# EAGLE design breakout (EAGLE 6.2)
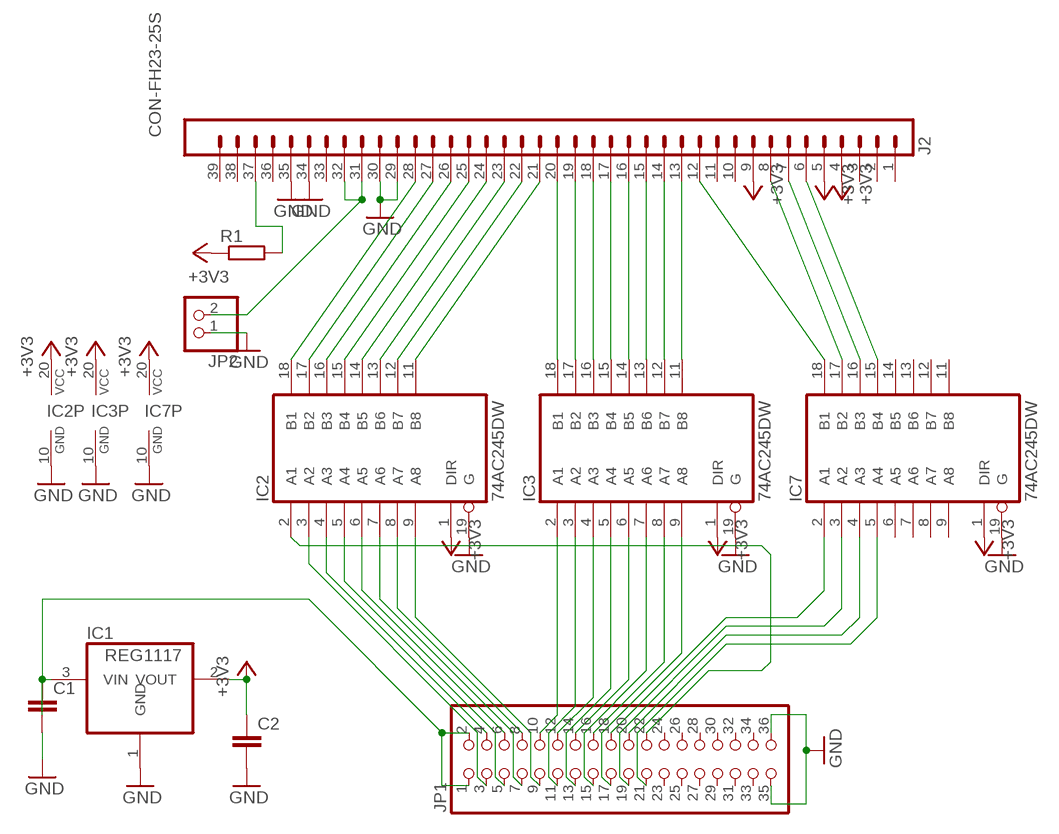
[diagram p0: schematic, sheet 1]

## Parts
C1  C-EUC0805  [C0805]
C2  C-EUC0805  [C0805]
IC1  REG1117  [SOT223]
IC2  74AC245DW  [SO20W]
IC3  74AC245DW  [SO20W]
IC7  74AC245DW  [SO20W]
J2  CON-FH23-25S  [FH23-25S]
JP1  PINHD-2X18  [2X18]
JP2  PINHD-1X2  [1X02]
R1  R-EU_R0805  [R0805]

## Nets
+3V3: C2.1 IC1.2(VOUT) IC2.1(DIR) IC2.20(VCC) IC3.1(DIR) IC3.20(VCC) IC7.1(DIR) IC7.20(VCC) J2.4 J2.5 J2.9 R1.1
GND: C1.2 C2.2 IC1.1(GND) IC2.10(GND) IC2.19(G) IC3.10(GND) IC3.19(G) IC7.10(GND) IC7.19(G) J2.29 J2.30 J2.34 J2.35 JP1.35 JP1.36 JP2.1
N$1: IC2.11(B8) J2.21
N$2: IC2.12(B7) J2.22
N$3: IC2.13(B6) J2.23
N$4: IC2.14(B5) J2.24
N$5: IC2.15(B4) J2.25
N$6: IC2.16(B3) J2.26
N$7: IC2.17(B2) J2.27
N$8: IC2.18(B1) J2.28
N$9: IC3.11(B8) J2.13
N$10: IC3.12(B7) J2.14
N$11: IC3.13(B6) J2.15
N$12: IC3.14(B5) J2.16
N$13: IC3.15(B4) J2.17
N$14: IC3.16(B3) J2.18
N$15: IC3.17(B2) J2.19
N$16: IC3.18(B1) J2.20
N$17: IC7.18(B1) J2.12
N$18: IC7.17(B2) J2.8
N$19: IC7.16(B3) J2.7
N$20: IC7.15(B4) J2.6
N$21: IC2.4(A3) JP1.4
N$22: IC2.6(A5) JP1.6
N$23: IC2.8(A7) JP1.8
N$24: IC3.2(A1) JP1.10
N$25: IC2.3(A2) JP1.3
N$26: IC2.5(A4) JP1.5
N$27: IC2.7(A6) JP1.7
N$28: IC2.9(A8) JP1.9
N$29: IC3.3(A2) JP1.11
N$30: IC3.4(A3) JP1.12
N$31: IC3.5(A4) JP1.13
N$32: IC3.6(A5) JP1.14
N$33: IC3.7(A6) JP1.15
N$34: IC3.8(A7) JP1.16
N$35: IC3.9(A8) JP1.17
N$36: IC7.2(A1) JP1.18
N$37: IC7.3(A2) JP1.19
N$38: IC7.4(A3) JP1.20
N$39: IC7.5(A4) JP1.21
N$40: IC2.2(A1) JP1.22
N$41: J2.37 R1.2
N$42: J2.31 J2.32 JP2.2
N$43: C1.1 IC1.3(VIN) JP1.1 JP1.2
Unconnected: IC7.6(A5) IC7.7(A6) IC7.8(A7) IC7.9(A8) IC7.11(B8) IC7.12(B7) IC7.13(B6) IC7.14(B5) J2.1 J2.2 J2.3 J2.10 J2.11 J2.33 J2.36 J2.38 J2.39 JP1.23 JP1.24 JP1.25 JP1.26 JP1.27 JP1.28 JP1.29 JP1.30 JP1.31 JP1.32 JP1.33 JP1.34

## Library data of the parts
C1 C2 = rcl:C-EU: CAPACITOR, European symbol
IC1 = burr-brown:REG1117: 800mA and 1A Low Dropout (LDO) Positive Regulator 1.8V, 2.5V, 2.85V, 3.3V, 5V, and Adj; MPN: REG1117; OC_FARNELL: 1097566; OC_NEWARK: 14P6981
IC2 IC3 IC7 = 74xx-eu:74*245: Octal BUS TRANSCEIVER, 3-state
J2 = dummylcd:CON-FH23-25S
JP1 = pinhead:PINHD-2X18: PIN HEADER
JP2 = pinhead:PINHD-1X2: PIN HEADER
R1 = rcl:R-EU_: RESISTOR, European symbol

## Board
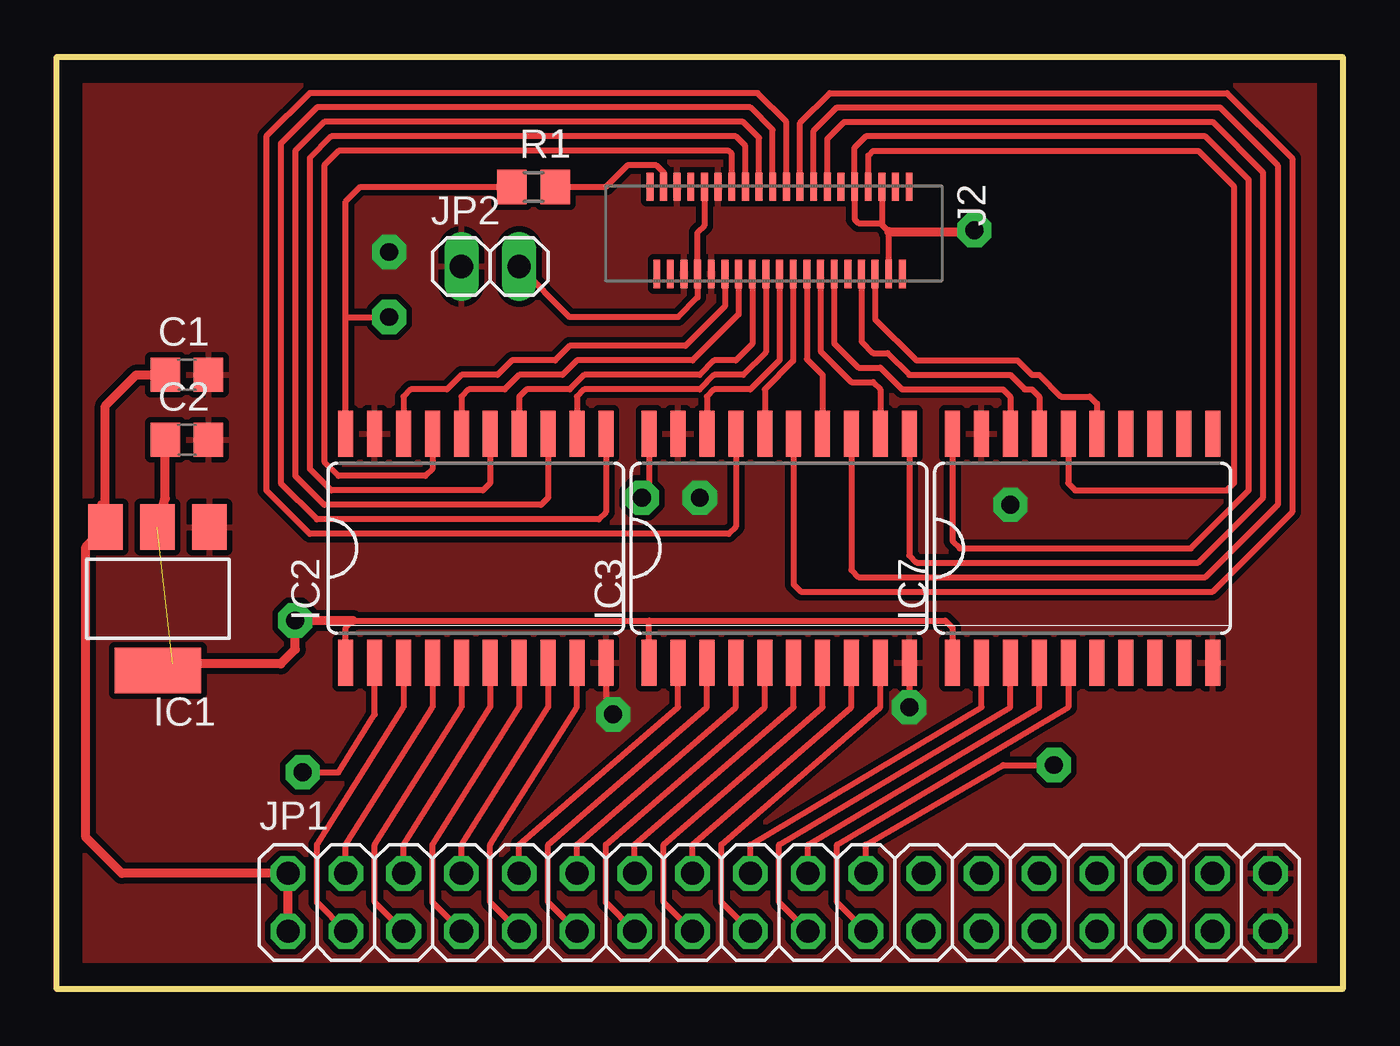
[diagram p1: board, top side]
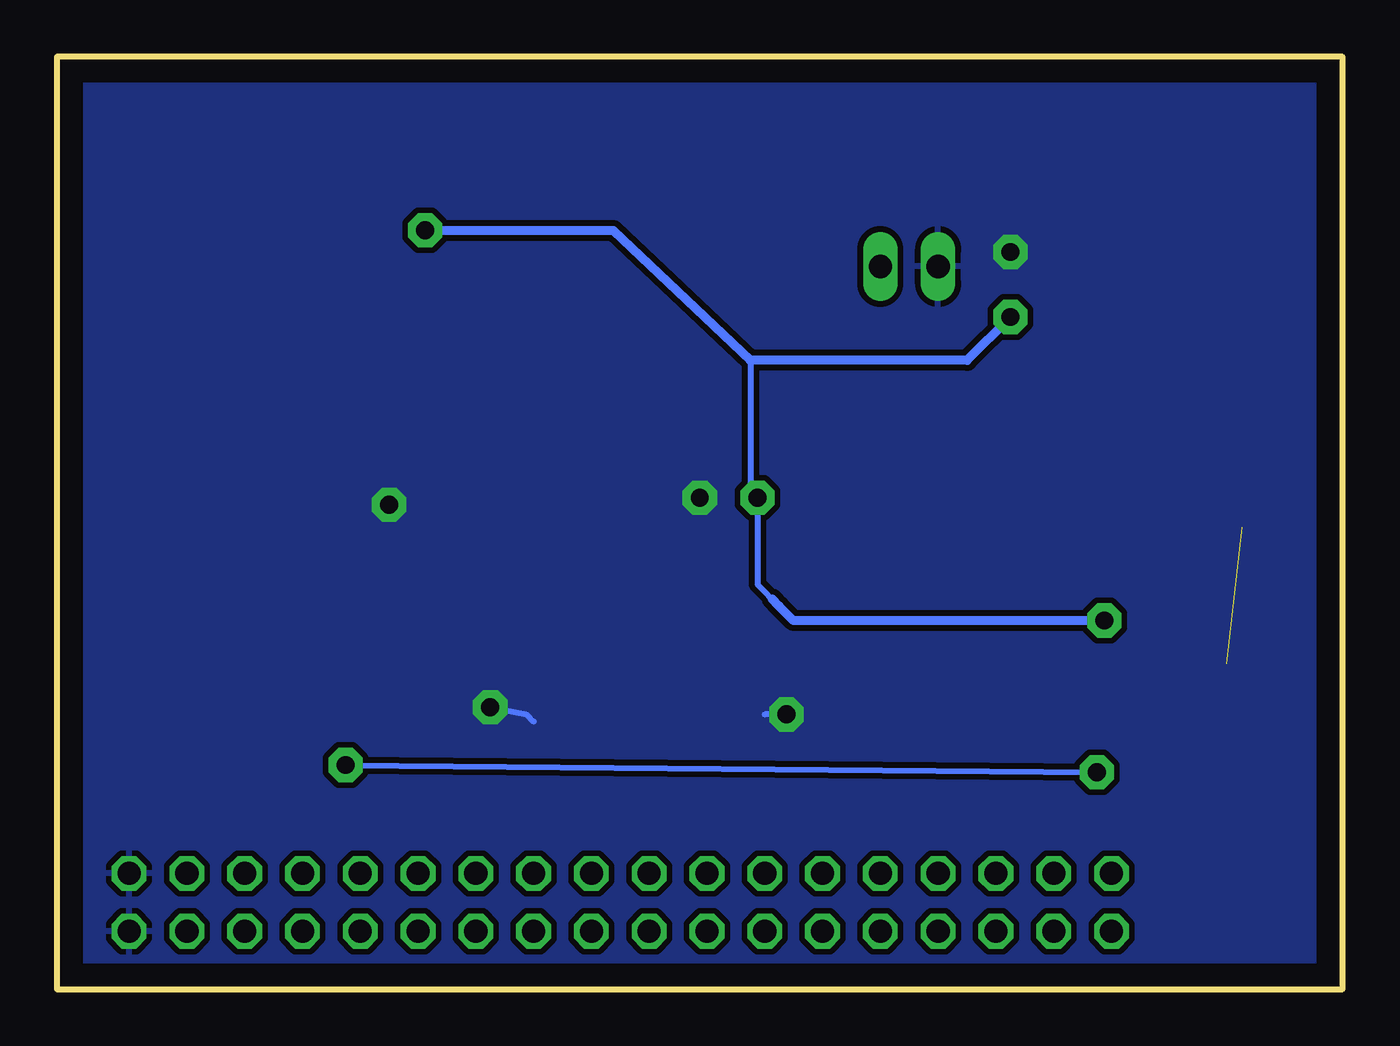
[diagram p2: board, bottom side, seen from below]

Size 56.52 x 40.96 mm. Coordinates in mm from the lower left corner, seen from the top.
Outline: 0,0 56.49,0 56.49,40.95 0,40.95 0,0
Outline: 0,0 56.52,0 56.52,40.96 0,40.96 0,0
Copper layers (1*16): Top 0.035mm / dielectric 1.5mm / Bottom 0.035mm
Design rules: minimum track width 8mil, minimum drill 0.8mm, track to track 7mil, track to pad 7mil, pad to pad 7mil, via to via 21mil, smd to smd 0mil, copper to edge 40mil, drill to drill 8mil, minimum pad ring 10mil, minimum via ring 8mil, stop-mask expansion 4mil, vias tented up to drill 0mil, thermal gap 10mil

### Footprints (pad centres in the part's own frame; a part is rotated, then mirrored left to right if it is on the bottom)
C0805 = smd 1.3 x 1.5: 1 -0.95,0; 2 0.95,0
SOT223 = smd 1.499 x 2.007: 1 -2.261,-3.15; 2 0.025,-3.15; 3 2.311,-3.15 | smd 3.81 x 2.007: 4 0,3.15
SO20W = smd 0.66 x 2.032: 1 -5.715,-5.029; 2 -4.445,-5.029; 3 -3.175,-5.029; 4 -1.905,-5.029; 5 -0.635,-5.029; 6 0.635,-5.029; 7 1.905,-5.029; 8 3.175,-5.029; 9 4.445,-5.029; 10 5.715,-5.029; 11 5.715,5.029; 12 4.445,5.029; 13 3.175,5.029; 14 1.905,5.029; 15 0.635,5.029; 16 -0.635,5.029; 17 -1.905,5.029; 18 -3.175,5.029; 19 -4.445,5.029; 20 -5.715,5.029
FH23-25S = smd 0.3 x 1.25: 1 0,0.625; 2 0.3,4.45; 3 0.6,0.625; 4 0.9,4.45; 5 1.2,0.625; 6 1.5,4.45; 7 1.8,0.625; 8 2.1,4.45; 9 2.4,0.625; 10 2.7,4.45; 11 3,0.625; 12 3.3,4.45; 13 3.6,0.625; 14 3.9,4.45; 15 4.2,0.625; 16 4.5,4.45; 17 4.8,0.625; 18 5.1,4.45; 19 5.4,0.625; 20 5.7,4.45; 21 6,0.625; 22 6.3,4.45; 23 6.6,0.625; 24 6.9,4.45; 25 7.2,0.625; 26 7.5,4.45; 27 7.8,0.625; 28 8.1,4.45; 29 8.4,0.625; 30 8.7,4.45; 31 9,0.625; 32 9.3,4.45; 33 9.6,0.625; 34 9.9,4.45; 35 10.2,0.625; 36 10.5,4.45; 37 10.8,0.625; 38 11.1,4.45; 39 11.4,0.625
2X18 = drill 1.016 octagon: 1 -21.59,-1.27; 2 -21.59,1.27; 3 -19.05,-1.27; 4 -19.05,1.27; 5 -16.51,-1.27; 6 -16.51,1.27; 7 -13.97,-1.27; 8 -13.97,1.27; 9 -11.43,-1.27; 10 -11.43,1.27; 11 -8.89,-1.27; 12 -8.89,1.27; 13 -6.35,-1.27; 14 -6.35,1.27; 15 -3.81,-1.27; 16 -3.81,1.27; 17 -1.27,-1.27; 18 -1.27,1.27; 19 1.27,-1.27; 20 1.27,1.27; 21 3.81,-1.27; 22 3.81,1.27; 23 6.35,-1.27; 24 6.35,1.27; 25 8.89,-1.27; 26 8.89,1.27; 27 11.43,-1.27; 28 11.43,1.27; 29 13.97,-1.27; 30 13.97,1.27; 31 16.51,-1.27; 32 16.51,1.27; 33 19.05,-1.27; 34 19.05,1.27; 35 21.59,-1.27; 36 21.59,1.27
1X02 = drill 1.016 long: 1 -1.27,0; 2 1.27,0
R0805 = smd 1.3 x 1.5: 1 -0.95,0; 2 0.95,0

### Placement (x,y rotation side)
C1  5.71,26.99 0 top
C2  5.71,24.13 0 top
IC1  4.44,17.14 180 top
IC2  18.41,19.37 0 top
IC3  31.75,19.37 0 top
IC7  45.09,19.37 0 top
J2  37.46,35.88 180 top
JP1  31.75,3.81 0 top
JP2  19.05,31.75 0 top
R1  20.95,35.24 0 top

### Tracks (layer width: path | path; a pad name or v marks a point on that pad's centre or on a via)
+3V3  (via drill 0.79 pad 1.5)  (1 unrouted)
  Top 0.254: IC2.1 12.7,15.88 13.02,16.19 26.03,16.19 | 26.03,16.19 39.05,16.19 39.37,15.88 IC7.1 | IC3.1 26.03,16.19 | J2.5 36.26,33.59 | 36.26,33.59 36.56,33.29 J2.4 | 36.26,33.59 36.19,33.66 35.24,33.66 35.06,33.83 J2.9 35.06,36.97 35.56,37.47 50.48,37.47 52.39,35.56 52.39,21.91 49.85,19.37 39.69,19.37 39.37,19.68 IC7.20 | 12.7,29.53 12.7,34.61 13.34,35.24 R1.1 | IC3.20 26.03,21.91 v25.72,21.59 | IC2.20 12.7,29.53 | 12.7,29.53 v14.6,29.53
  Top 0.406: IC1.2 4.76,21.57 C2.1 | 4.76,13.97 5.08,14.29 9.84,14.29 10.48,14.92 v10.48,16.19 13.02,16.19 | 36.56,33.29 40.32,33.29 v40.32,33.34
  Bottom 0.254: 24.76,16.83 25.72,17.78 v25.72,21.59 26.03,21.91 26.03,27.62
  Bottom 0.406: v10.48,16.19 24.13,16.19 24.76,16.83 25.08,17.14 | v40.32,33.34 32.07,33.34 26.03,27.62 16.51,27.62 v14.6,29.53
GND  (via drill 0.79 pad 1.5)
  Top 0.254: IC2.10 24.13,12.38 v24.45,12.07 | IC3.10 v37.46,12.38
  Bottom 0.254: v24.45,12.07 25.4,12.07 | v37.46,12.38 35.88,12.07 35.56,11.75
  other vias: 28.26,21.59 41.91,21.27 14.61,32.38
  pour Top (isolate 0.254): -23.81,73.34 93.98,73.34 115.57,-7.3 -14.6,-7.62
  pour Bottom (isolate 0.254): -14.29,-5.71 -28.58,78.74 91.12,81.92 94.3,-5.71
N$1
  Top 0.254: IC2.11 24.13,20.96 23.81,20.64 11.43,20.64 9.84,22.23 9.84,37.15 11.43,38.73 30.48,38.73 31.46,37.75 J2.21
N$2
  Top 0.254: J2.22 31.17,27.99 30.16,26.99 28.89,26.99 28.26,26.35 23.18,26.35 22.86,26.04 IC2.12
N$3
  Top 0.254: IC2.13 21.59,21.59 21.27,21.27 11.75,21.27 10.48,22.54 10.48,36.83 11.75,38.1 30.16,38.1 30.87,37.4 J2.23
N$4
  Top 0.254: J2.24 30.56,28.34 29.85,27.62 28.89,27.62 28.26,26.99 23.18,26.99 22.54,26.35 20.64,26.35 20.32,26.04 IC2.14
N$5
  Top 0.254: IC2.15 19.05,22.23 18.73,21.91 12.07,21.91 11.11,22.86 11.11,36.51 12.07,37.47 29.85,37.47 30.26,37.05 J2.25
N$6
  Top 0.254: J2.26 29.96,29.65 27.94,27.62 22.86,27.62 22.22,26.99 20.32,26.99 19.69,26.35 18.1,26.35 17.78,26.04 IC2.16
N$7
  Top 0.254: IC2.17 16.51,22.86 16.19,22.54 12.38,22.54 11.75,23.18 11.75,36.2 12.38,36.83 29.53,36.83 29.67,36.69 J2.27
N$8
  Top 0.254: J2.28 29.37,30 27.62,28.26 22.54,28.26 21.91,27.62 20,27.62 19.37,26.99 17.78,26.99 17.14,26.35 15.56,26.35 15.24,26.04 IC2.18
N$9
  Top 0.254: J2.13 33.87,37.36 34.61,38.1 50.8,38.1 53.02,35.88 53.02,21.59 50.17,18.73 37.78,18.73 37.46,19.05 IC3.11
N$10
  Top 0.254: J2.14 33.56,28.03 34.92,26.67 35.88,26.67 36.19,26.35 IC3.12
N$11
  Top 0.254: J2.15 33.26,37.71 34.29,38.73 51.12,38.73 53.66,36.2 53.66,21.27 50.48,18.1 35.24,18.1 34.92,18.41 IC3.13
N$12
  Top 0.254: J2.16 32.96,27.68 33.65,26.99 IC3.14
N$13
  Top 0.254: J2.17 32.67,38.06 33.97,39.37 51.43,39.37 54.29,36.51 54.29,20.96 50.8,17.46 32.7,17.46 32.38,17.78 IC3.15
N$14
  Top 0.254: J2.18 32.37,27.6 31.12,26.35 IC3.16
N$15
  Top 0.254: IC3.17 29.85,20.32 29.53,20 11.11,20 9.21,21.91 9.21,37.47 11.11,39.37 30.8,39.37 32.06,38.1 J2.19
N$16
  Top 0.254: J2.20 31.76,27.64 30.48,26.35 28.89,26.35 28.58,26.04 IC3.18
N$17
  Top 0.254: J2.12 34.17,28.38 35.24,27.3 36.19,27.3 37.15,26.35 41.59,26.35 41.91,26.04 IC7.18
N$18
  Top 0.254: J2.8 35.37,28.45 35.88,27.94 36.51,27.94 37.46,26.99 41.91,26.99 42.54,26.35 42.86,26.35 43.18,26.04 IC7.17
N$19
  Top 0.254: J2.7 35.67,36.62 35.88,36.83 50.17,36.83 51.75,35.24 51.75,22.23 51.43,21.91 44.77,21.91 44.45,22.23 IC7.16
N$20
  Top 0.254: J2.6 35.96,29.44 37.78,27.62 42.23,27.62 42.86,26.99 43.18,26.99 44.13,26.04 45.4,26.04 45.72,25.72 IC7.15
N$21
  Top 0.254: JP1.4 12.7,6.35 16.51,12.38 IC2.4
N$22
  Top 0.254: JP1.6 15.24,6.35 19.05,12.38 IC2.6
N$23
  Top 0.254: JP1.8 17.78,6.35 21.59,12.38 IC2.8
N$24
  Top 0.254: JP1.10 20.32,6.35 27.31,12.38 IC3.2
N$25
  Top 0.254: JP1.3 11.43,3.81 11.43,6.35 15.24,12.38 IC2.3
N$26
  Top 0.254: JP1.5 13.97,3.81 13.97,6.35 17.78,12.38 IC2.5
N$27
  Top 0.254: JP1.7 16.51,3.81 16.51,6.35 20.32,12.38 IC2.7
N$28
  Top 0.254: JP1.9 19.05,3.81 19.05,6.35 22.86,12.38 IC2.9
N$29
  Top 0.254: JP1.11 21.59,3.81 21.59,6.35 28.58,12.38 IC3.3
N$30
  Top 0.254: JP1.12 22.86,6.35 29.85,12.38 IC3.4
N$31
  Top 0.254: JP1.13 24.13,3.81 24.13,6.35 31.12,12.38 IC3.5
N$32
  Top 0.254: JP1.14 25.4,6.35 32.38,12.38 IC3.6
N$33
  Top 0.254: JP1.15 26.67,3.81 26.67,6.35 33.65,12.38 IC3.7
N$34
  Top 0.254: JP1.16 27.94,6.35 34.92,12.38 IC3.8
N$35
  Top 0.254: JP1.17 29.21,3.81 29.21,6.35 36.19,12.38 IC3.9
N$36
  Top 0.254: JP1.18 30.48,6.35 40.64,12.38 IC7.2
N$37
  Top 0.254: JP1.19 31.75,3.81 31.75,6.35 41.91,12.38 IC7.3
N$38
  Top 0.254: JP1.20 33.02,6.35 43.18,12.38 IC7.4
N$39
  Top 0.254: JP1.21 34.29,3.81 34.29,6.35 44.45,12.38 IC7.5
N$40  (via drill 0.79 pad 1.5)
  Top 0.254: JP1.22 35.56,6.35 41.59,9.84 v43.81,9.84 | v10.8,9.53 12.38,9.53 13.97,12.07 IC2.2
  Bottom 0.254: v43.81,9.84 v10.8,9.53
N$41
  Top 0.254: R1.2 24.13,35.24 25.08,36.2 26.35,36.2 26.67,35.88 J2.37
N$42
  Top 0.254: J2.31 28.46,33.55 28.17,33.25 J2.32 28.17,30.39 27.31,29.53 22.54,29.53 JP2.2
N$43
  Top 0.254: 1.9,21.34 IC1.3
  Top 0.406: C1.1 3.49,26.99 2.13,25.63 IC1.3 1.27,19.43 1.27,6.67 2.86,5.08 JP1.2 JP1.1